# EAGLE design Kube_LoRaWAN_Module (EAGLE 9.6.2)
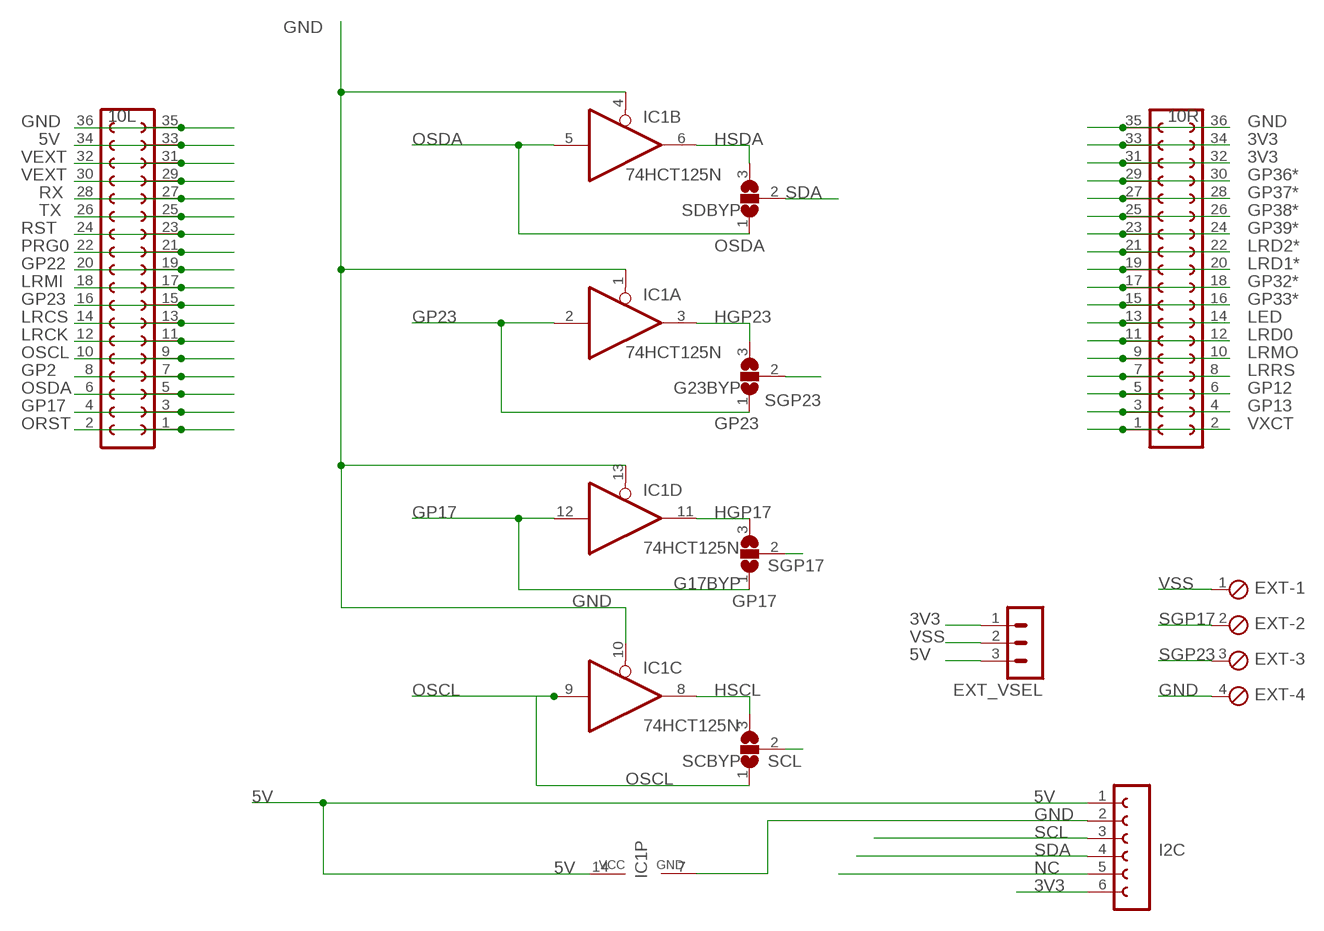
[diagram p0: schematic, sheet 1]

## Parts
10L  15  FE18-2  [FE18-2]
10R  15  FE18-2  [FE18-2]
EXT  MPT4  [4POL254]
EXT_VSEL  MA03-1  [MA03-1]
G17BYP  SJ2W  [SJ_2]
G23BYP  SJ2W  [SJ_2]
I2C  FE06-1  [FE06]
IC1  74HCT125N  [DIL14]
SCBYP  SJ2W  [SJ_2]
SDBYP  SJ2W  [SJ_2]

## Nets
3V3: 10R.31 10R.32 10R.33 10R.34 EXT_VSEL.1 I2C.6
5V: 10L.33 10L.34 EXT_VSEL.3 I2C.1 IC1.14(P:VCC)
GND: 10L.35 10L.36 10R.35 10R.36 EXT.4 I2C.2 IC1.1(A:OE) IC1.4(B:OE) IC1.7(P:GND) IC1.10(C:OE) IC1.13(D:OE)
GP2: 10L.7 10L.8
GP12: 10R.5 10R.6
GP13: 10R.3 10R.4
GP17: 10L.3 10L.4 G17BYP.1 IC1.12(D:I)
GP22: 10L.19 10L.20
GP23: 10L.15 10L.16 G23BYP.1 IC1.2(A:I)
GP32*: 10R.17 10R.18
GP33*: 10R.15 10R.16
GP36*: 10R.29 10R.30
GP37*: 10R.27 10R.28
GP38*: 10R.25 10R.26
GP39*: 10R.23 10R.24
HGP17: G17BYP.3 IC1.11(D:O)
HGP23: G23BYP.3 IC1.3(A:O)
HSCL: IC1.8(C:O) SCBYP.3
HSDA: IC1.6(B:O) SDBYP.3
LED: 10R.13 10R.14
LRCK: 10L.11 10L.12
LRCS: 10L.13 10L.14
LRD0: 10R.11 10R.12
LRD1*: 10R.19 10R.20
LRD2*: 10R.21 10R.22
LRMI: 10L.17 10L.18
LRMO: 10R.9 10R.10
LRRS: 10R.7 10R.8
NC: I2C.5
ORST: 10L.1 10L.2
OSCL: 10L.9 10L.10 IC1.9(C:I) SCBYP.1
OSDA: 10L.5 10L.6 IC1.5(B:I) SDBYP.1
PRG0: 10L.21 10L.22
RST: 10L.23 10L.24
RX: 10L.27 10L.28
SCL: I2C.3 SCBYP.2
SDA: I2C.4 SDBYP.2
SGP17: EXT.2 G17BYP.2
SGP23: EXT.3 G23BYP.2
TX: 10L.25 10L.26
VEXT: 10L.29 10L.30 10L.31 10L.32
VSS: EXT.1 EXT_VSEL.2
VXCT: 10R.1 10R.2

## Library data of the parts
10L 10R = con-lsta:FE18-2: FEMALE HEADER; OC_FARNELL: unknown; OC_NEWARK: unknown
EXT = con-phoenix-254:MPT4: PHOENIX CONNECTOR; OC_FARNELL: unknown; OC_NEWARK: unknown
EXT_VSEL = con-lstb:MA03-1: PIN HEADER; OC_FARNELL: unknown; OC_NEWARK: unknown
G17BYP G23BYP SCBYP SDBYP = jumper:SJ2W: SMD solder JUMPER
I2C = con-lsta:FE06-1: FEMALE HEADER; OC_FARNELL: unknown; OC_NEWARK: unknown
IC1 = 74xx-eu:74*125: Quad bus BUFFER, 3-state

## Board
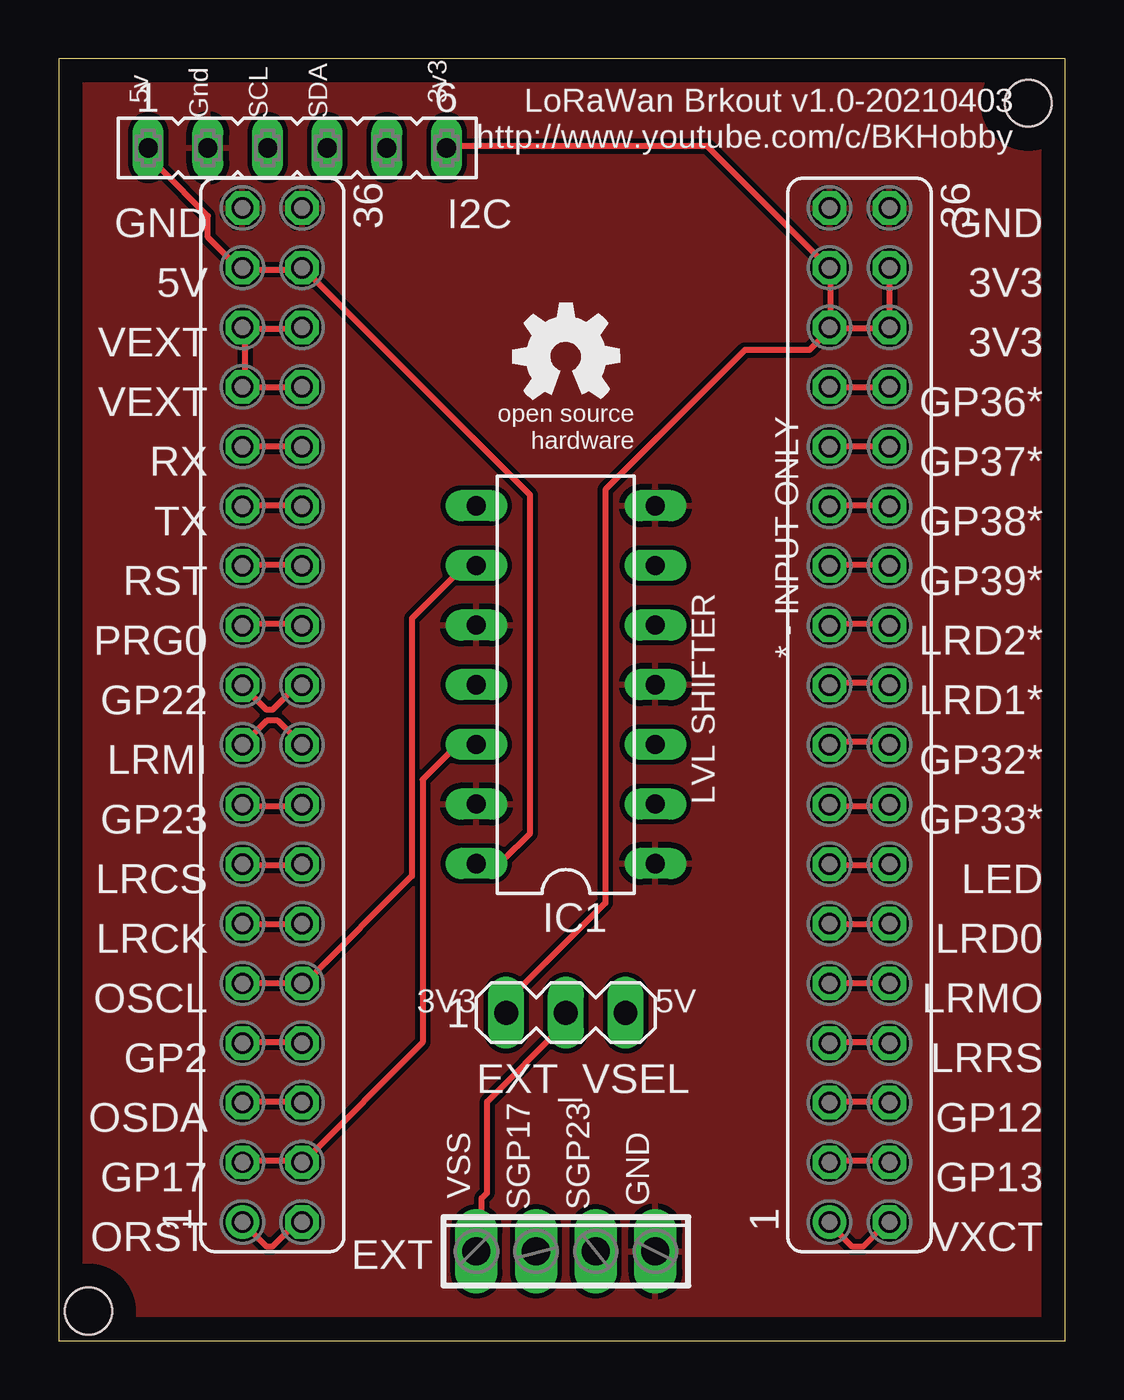
[diagram p1: board, top side]
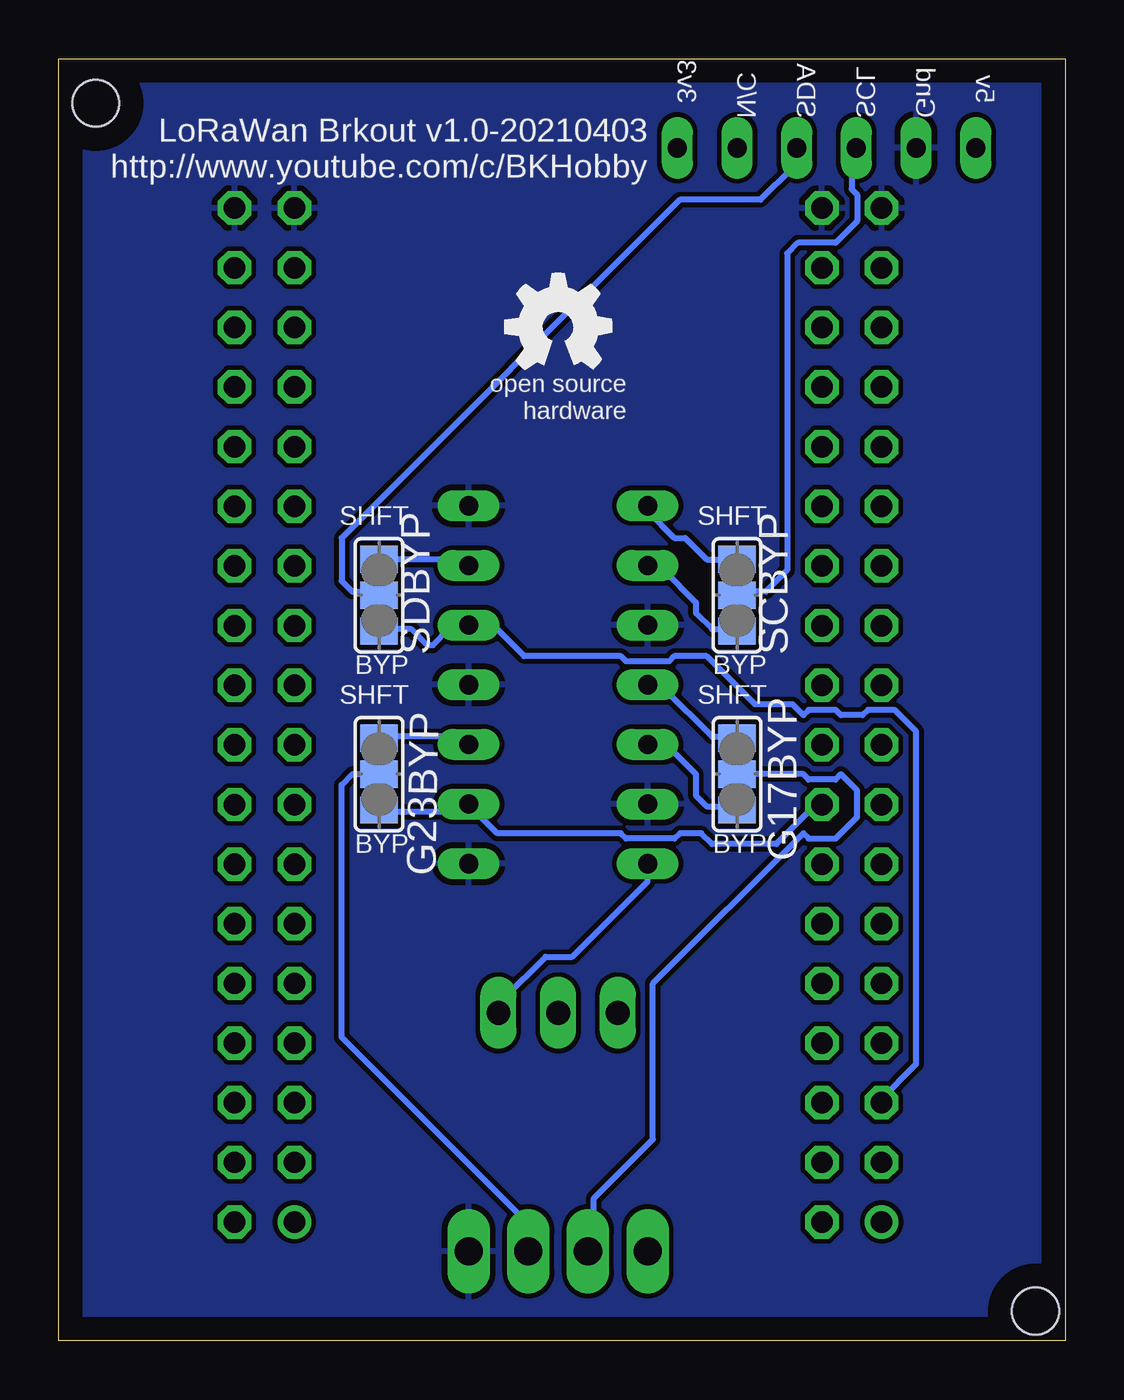
[diagram p2: board, bottom side, seen from below]

Size 42.85 x 54.6 mm. Coordinates in mm from the lower left corner, seen from the top.
Outline: 0,0 42.85,0 42.85,54.6 0,54.6 0,0
Copper layers (1*16): Top 0.035mm / dielectric 1.5mm / Bottom 0.035mm
Design rules "default": minimum track width 10mil, minimum drill 24mil, track to track 8mil, track to pad 8mil, pad to pad 8mil, via to via 8mil, smd to smd 8mil, copper to edge 40mil, drill to drill 8mil, minimum pad ring 10mil, minimum via ring 8mil, stop-mask expansion 4mil, vias tented up to drill 0mil, thermal gap 10mil
Holes 2 mm at 41.27,52.7 1.27,1.27

### Footprints (pad centres in the part's own frame; a part is rotated, then mirrored left to right if it is on the bottom)
FE18-2 = drill 0.914: 1 -21.59,1.27 | drill 0.914 octagon: 2 -21.59,-1.27; 3 -19.05,1.27; 4 -19.05,-1.27; 5 -16.51,1.27; 6 -16.51,-1.27; 7 -13.97,1.27; 8 -13.97,-1.27; 9 -11.43,1.27; 10 -11.43,-1.27; 11 -8.89,1.27; 12 -8.89,-1.27; 13 -6.35,1.27; 14 -6.35,-1.27; 15 -3.81,1.27; 16 -3.81,-1.27; 17 -1.27,1.27; 18 -1.27,-1.27; 19 1.27,1.27; 20 1.27,-1.27; 21 3.81,1.27; 22 3.81,-1.27; 23 6.35,1.27; 24 6.35,-1.27; 25 8.89,1.27; 26 8.89,-1.27; 27 11.43,1.27; 28 11.43,-1.27; 29 13.97,1.27; 30 13.97,-1.27; 31 16.51,1.27; 32 16.51,-1.27; 33 19.05,1.27; 34 19.05,-1.27; 35 21.59,1.27; 36 21.59,-1.27
4POL254 = drill 1.2 long: 1 -3.81,0; 2 -1.27,0; 3 1.27,0; 4 3.81,0
MA03-1 = drill 1.016 long: 1 -2.54,0; 2 0,0; 3 2.54,0
SJ_2 = smd 1.168 x 1.6: 1 -1.524,0; 2 0,0; 3 1.524,0
FE06 = drill 0.813 long: 1 -6.35,0; 2 -3.81,0; 3 -1.27,0; 4 1.27,0; 5 3.81,0; 6 6.35,0
DIL14 = drill 0.813 long: 1 -7.62,-3.81; 2 -5.08,-3.81; 3 -2.54,-3.81; 4 0,-3.81; 5 2.54,-3.81; 6 5.08,-3.81; 7 7.62,-3.81; 8 7.62,3.81; 9 5.08,3.81; 10 2.54,3.81; 11 0,3.81; 12 -2.54,3.81; 13 -5.08,3.81; 14 -7.62,3.81

### Placement (x,y rotation side)
10L  9.09,26.65 90 top
10R  34.09,26.65 90 top
EXT  21.59,3.81 0 top
EXT_VSEL  21.59,13.97 0 top
G17BYP  13.97,24.13 90 bottom
G23BYP  29.21,24.13 90 bottom
I2C  10.16,50.8 0 top
IC1  21.59,27.94 90 top
SCBYP  13.97,31.75 90 bottom
SDBYP  29.21,31.75 90 bottom
U$1  [OSHW_5MM]  21.59,41.91 0 top
U$2  [OSHW_5MM]  21.59,43.18 0 bottom

### Tracks (layer width: path | path; a pad name or v marks a point on that pad's centre or on a via)
3V3
  Top 0.254: I2C.6 16.64,50.88 27.61,50.88 32.64,45.85 10R.33 32.87,45.62 32.87,43.33 10R.31 32.87,43.1 | 32.87,43.1 35.15,43.1 10R.32 35.38,43.33 35.38,45.62 10R.34 | 32.87,43.1 31.95,42.19 29.21,42.19 23.27,36.25 23.27,18.64 19.15,14.53 19.15,14.07 EXT_VSEL.1
5V
  Top 0.254: I2C.1 3.83,50.65 4.29,50.19 4.29,49.96 6.35,47.9 6.35,46.99 7.72,45.62 10L.33 7.95,45.62 10.24,45.62 10L.34 10.46,45.62 20.07,36.02 20.07,21.61 18.92,20.47 17.78,20.47 IC1.14
  Bottom 0.254: IC1.14 17.78,19.56 20.98,16.36 22.12,16.36 23.95,14.53 23.95,14.07 EXT_VSEL.3
GND
  pour Top: 0,0 0,54.61 43.18,54.61 43.18,0
  pour Bottom: 0,0 0,54.61 43.18,54.61 43.18,0
GP2
  Top 0.254: 10L.7 7.95,12.7 10.24,12.7 10L.8
GP12
  Top 0.254: 10R.5 32.87,10.18 35.15,10.18 10R.6
GP13
  Top 0.254: 10R.3 32.87,7.67 35.15,7.67 10R.4
GP17
  Top 0.254: 10L.3 7.95,7.67 10.24,7.67 10L.4 10.46,7.67 15.49,12.7 15.49,23.9 16.87,25.27 17.78,25.27 IC1.12
  Bottom 0.254: G17BYP.1 14.12,22.76 15.26,22.76 15.72,23.22 15.72,24.13 16.87,25.27 17.78,25.27 IC1.12
GP22
  Top 0.254: 10L.19 7.95,27.79 8.86,26.87 9.09,26.87 10.24,28.02 10L.20
GP23
  Top 0.254: 10L.15 7.95,22.76 10.24,22.76 10L.16
  Bottom 0.254: G23BYP.1 29.21,22.53 25.78,22.53 25.55,22.76 IC1.2 25.32,22.76 24.18,21.61 18.92,21.61 18.69,21.39 16.64,21.39 16.41,21.61 15.49,21.61 15.04,21.16 12.29,21.16 10.46,22.99 10L.16
GP32*
  Top 0.254: 10R.17 32.87,25.5 35.15,25.5 10R.18
GP33*
  Top 0.254: 10R.15 32.87,22.76 35.15,22.76 10R.16
GP36*
  Top 0.254: 10R.29 32.87,40.59 35.15,40.59 10R.30
GP37*
  Top 0.254: 10R.27 32.87,38.08 35.15,38.08 10R.28
GP38*
  Top 0.254: 10R.25 32.87,35.56 35.15,35.56 10R.26
GP39*
  Top 0.254: 10R.23 32.87,33.05 35.15,33.05 10R.24
HGP17
  Bottom 0.254: G17BYP.3 14.12,25.73 15.04,25.73 17.09,27.79 17.78,27.79 IC1.11
HGP23
  Bottom 0.254: G23BYP.3 29.21,25.73 25.78,25.73 25.55,25.5 IC1.3
HSCL
  Bottom 0.254: SCBYP.3 15.26,33.27 16.18,34.19 16.64,34.19 17.78,35.33 IC1.8
HSDA
  Bottom 0.254: SDBYP.3 25.78,33.27 25.55,33.05 IC1.6
LED
  Top 0.254: 10R.13 32.87,20.24 35.15,20.24 10R.14
LRCK
  Top 0.254: 10L.11 7.95,17.73 10.24,17.73 10L.12
LRCS
  Top 0.254: 10L.13 7.95,20.24 10.24,20.24 10L.14
LRD0
  Top 0.254: 10R.11 32.87,17.73 35.15,17.73 10R.12
LRD1*
  Top 0.254: 10R.19 32.87,28.02 35.15,28.02 10R.20
LRD2*
  Top 0.254: 10R.21 32.87,30.53 35.15,30.53 10R.22
LRMI
  Top 0.254: 10L.17 7.95,25.5 8.86,26.42 9.32,26.42 10.24,25.5 10L.18
LRMO
  Top 0.254: 10R.9 32.87,15.21 35.15,15.21 10R.10
LRRS
  Top 0.254: 10R.7 32.87,12.7 35.15,12.7 10R.8
ORST
  Top 0.254: 10L.1 7.95,4.93 8.86,4.01 9.09,4.01 10.24,5.16 10L.2
OSCL
  Top 0.254: 10L.9 7.95,15.21 10.24,15.21 10L.10 10.46,15.44 10.69,15.44 15.04,19.79 15.04,30.76 17.09,32.82 17.78,32.82 IC1.9
  Bottom 0.254: SCBYP.1 14.12,30.3 15.04,30.3 15.72,30.99 15.72,31.44 17.09,32.82 17.78,32.82 IC1.9
OSDA
  Top 0.254: 10L.5 7.95,10.18 10.24,10.18 10L.6
  Bottom 0.254: SDBYP.1 29.21,30.3 27.84,30.3 27.15,29.62 26.92,29.62 26.24,30.3 25.55,30.3 IC1.5 25.32,30.3 24.18,30.3 23.04,29.16 18.92,29.16 18.69,28.93 16.87,28.93 16.64,29.16 15.26,29.16 13.21,27.1 11.61,27.1 11.15,26.64 10.92,26.87 9.78,26.87 9.55,26.64 8.64,26.64 8.41,26.87 7.26,26.87 6.35,25.96 6.35,11.79 7.95,10.18 10L.5
PRG0
  Top 0.254: 10L.21 7.95,30.53 10.24,30.53 10L.22
RST
  Top 0.254: 10L.23 7.95,33.05 10.24,33.05 10L.24
RX
  Top 0.254: 10L.27 7.95,38.08 10.24,38.08 10L.28
SCL
  Bottom 0.254: SCBYP.2 13.89,31.9 12.75,31.9 11.84,32.82 11.84,46.3 11.38,46.76 9.78,46.76 8.86,47.68 8.86,48.82 9.09,49.05 9.09,50.65 I2C.3
SDA
  Bottom 0.254: SDBYP.2 29.21,31.9 30.35,31.9 30.81,32.36 30.81,34.19 16.41,48.59 12.98,48.59 11.61,49.96 11.61,50.65 I2C.4
SGP17
  Bottom 0.254: G17BYP.2 11.15,24.13 10.92,23.9 9.78,23.9 9.55,24.13 8.86,23.44 8.86,22.3 9.78,21.39 10.92,21.39 11.15,21.61 17.55,15.21 17.55,8.59 20.07,6.07 20.07,4.24 20.29,4.01 EXT.2
SGP23
  Bottom 0.254: G23BYP.2 30.35,24.13 30.81,23.67 30.81,12.93 23.04,5.16 23.04,4.01 EXT.3
TX
  Top 0.254: 10L.25 7.95,35.56 10.24,35.56 10L.26
VEXT
  Top 0.254: 10L.30 10.24,40.59 7.95,40.59 10L.29 7.95,40.82 7.95,43.1 | 7.95,43.1 10.24,43.1 10L.32 | 7.95,43.1 10L.31
VSS
  Top 0.254: EXT_VSEL.2 21.44,13.84 21.44,13.39 18.24,10.18 18.24,6.3 18.01,6.07 18.01,4.24 17.78,4.01 EXT.1
VXCT
  Top 0.254: 10R.1 32.87,4.93 33.78,4.01 34.24,4.01 35.15,4.93 10R.2

### Text on the board
tNames: LoRaWan Brkout v1.0-20210403 / http://www.youtube.com/c/BKHobby | 5v | 3v3 | Gnd | SCL | SDA | GND | GND | 5V | 3V3 | VEXT | 3V3 | VEXT | GP36* | * - INPUT ONLY | RX | GP37* | TX | GP38* | RST | GP39* | PRG0 | LRD2* | GP22 | LRD1* | LRMI | GP32* | GP23 | LVL SHIFTER | GP33* | LRCS | LED | LRCK | LRD0 | OSCL | LRMO | 3V3 | 5V | GP2 | LRRS | OSDA | SGP17 | SGP23 | GP12 | VSS | GND | GP17 | GP13 | ORST | VXCT
bNames: 5v | 3v3 | Gnd | SCL | SDA | N/C | LoRaWan Brkout v1.0-20210403 / http://www.youtube.com/c/BKHobby | SHFT | SHFT | BYP | BYP | SHFT | SHFT | BYP | BYP